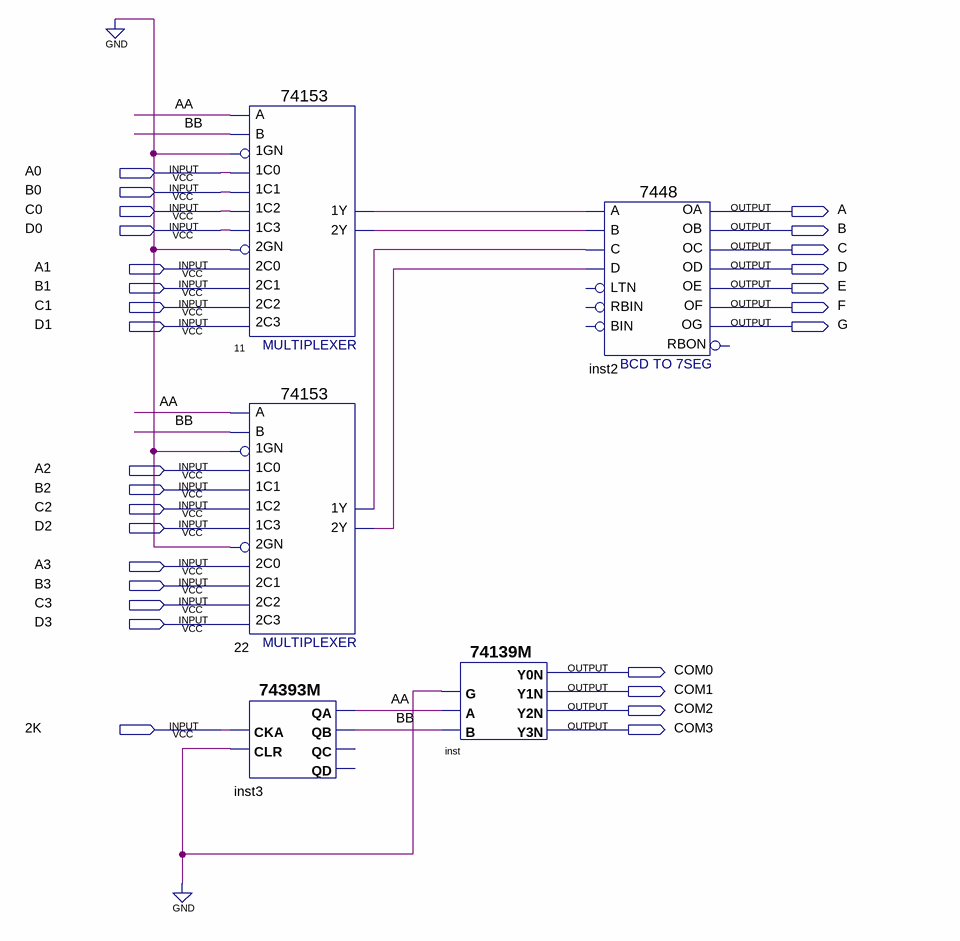
[diagram p0: schematic sheet]
// Quartus schematic 4SEG.bdf as structural Verilog: 5 symbols, 28 pins
module \4SEG  (
  input  A0,
  input  B0,
  input  C0,
  input  D0,
  input  A1,
  input  B1,
  input  C1,
  input  D1,
  input  A2,
  input  B2,
  input  C2,
  input  D2,
  input  A3,
  input  B3,
  input  C3,
  input  D3,
  input  \2K ,
  output A,
  output B,
  output C,
  output D,
  output E,
  output F,
  output G,
  output COM0,
  output COM1,
  output COM2,
  output COM3
);

  wire AA, BB, n11_1y, n11_2y, n22_1y, n22_2y;

  \74153  u_11 (
    .\1C1 (B0), .\1GN (1'b0), .\1C0 (A0), .\2C0 (A1), .\2GN (1'b0), .\2C2 (C1), .\1C2 (C0), .\1C3 (D0),
    .B(BB), .A(AA), .\2C1 (B1), .\2C3 (D1), .\1Y (n11_1y), .\2Y (n11_2y));
  \74153  u_22 (
    .\1C1 (B2), .\1GN (1'b0), .\1C0 (A2), .\2C0 (A3), .\2GN (1'b0), .\2C2 (C3), .\1C2 (C2), .\1C3 (D2),
    .B(BB), .A(AA), .\2C1 (B3), .\2C3 (D3), .\1Y (n22_1y), .\2Y (n22_2y));
  \74393M  inst3 (.CLR(1'b0), .CKA(\2K ), .QB(BB), .QA(AA));  // open: QC, QD
  \74139M  inst (.B(BB), .A(AA), .G(1'b0), .Y3N(COM3), .Y2N(COM2), .Y0N(COM0), .Y1N(COM1));
  \7448  inst2 (
    .A(n11_1y), .C(n22_1y), .D(n22_2y), .B(n11_2y), .OC(C), .OE(E), .OD(D), .OF(F), .OG(G), .OB(B), .OA(A));  // open: RBIN, BIN, LTN, RBON
endmodule
